# EAGLE design wall-e (EAGLE 8.1.0)
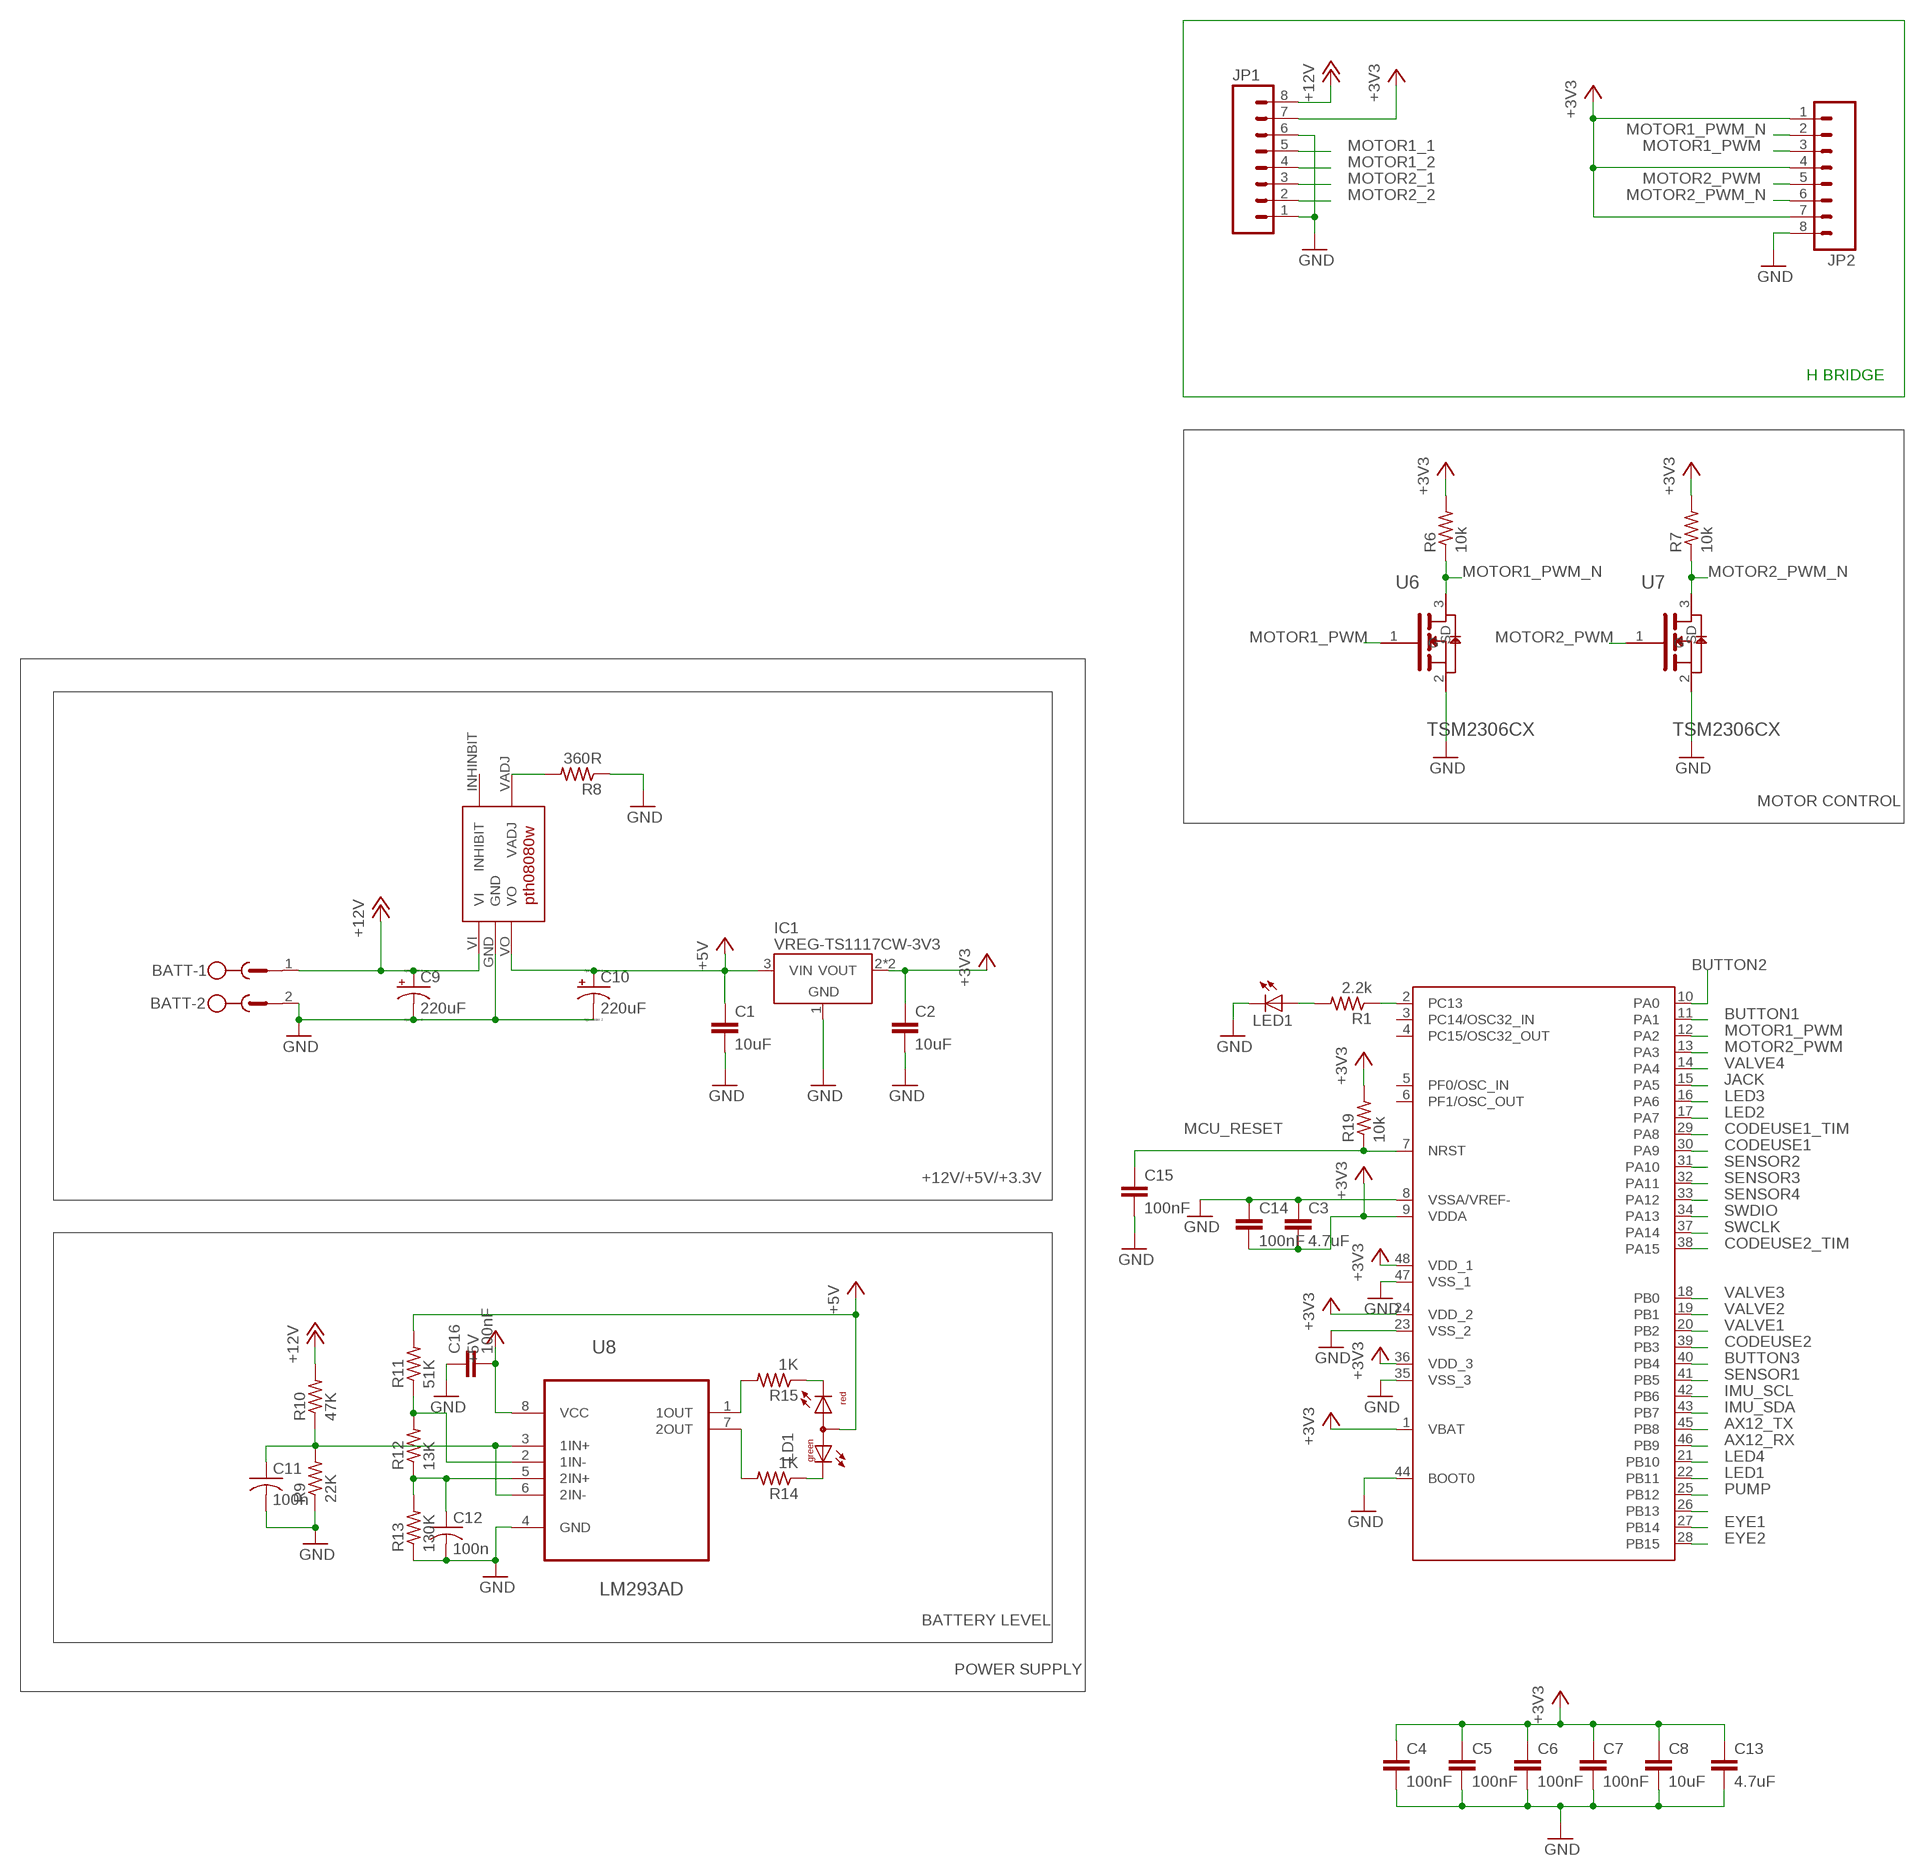
[diagram p0: schematic, sheet 1, part 1 of 2]
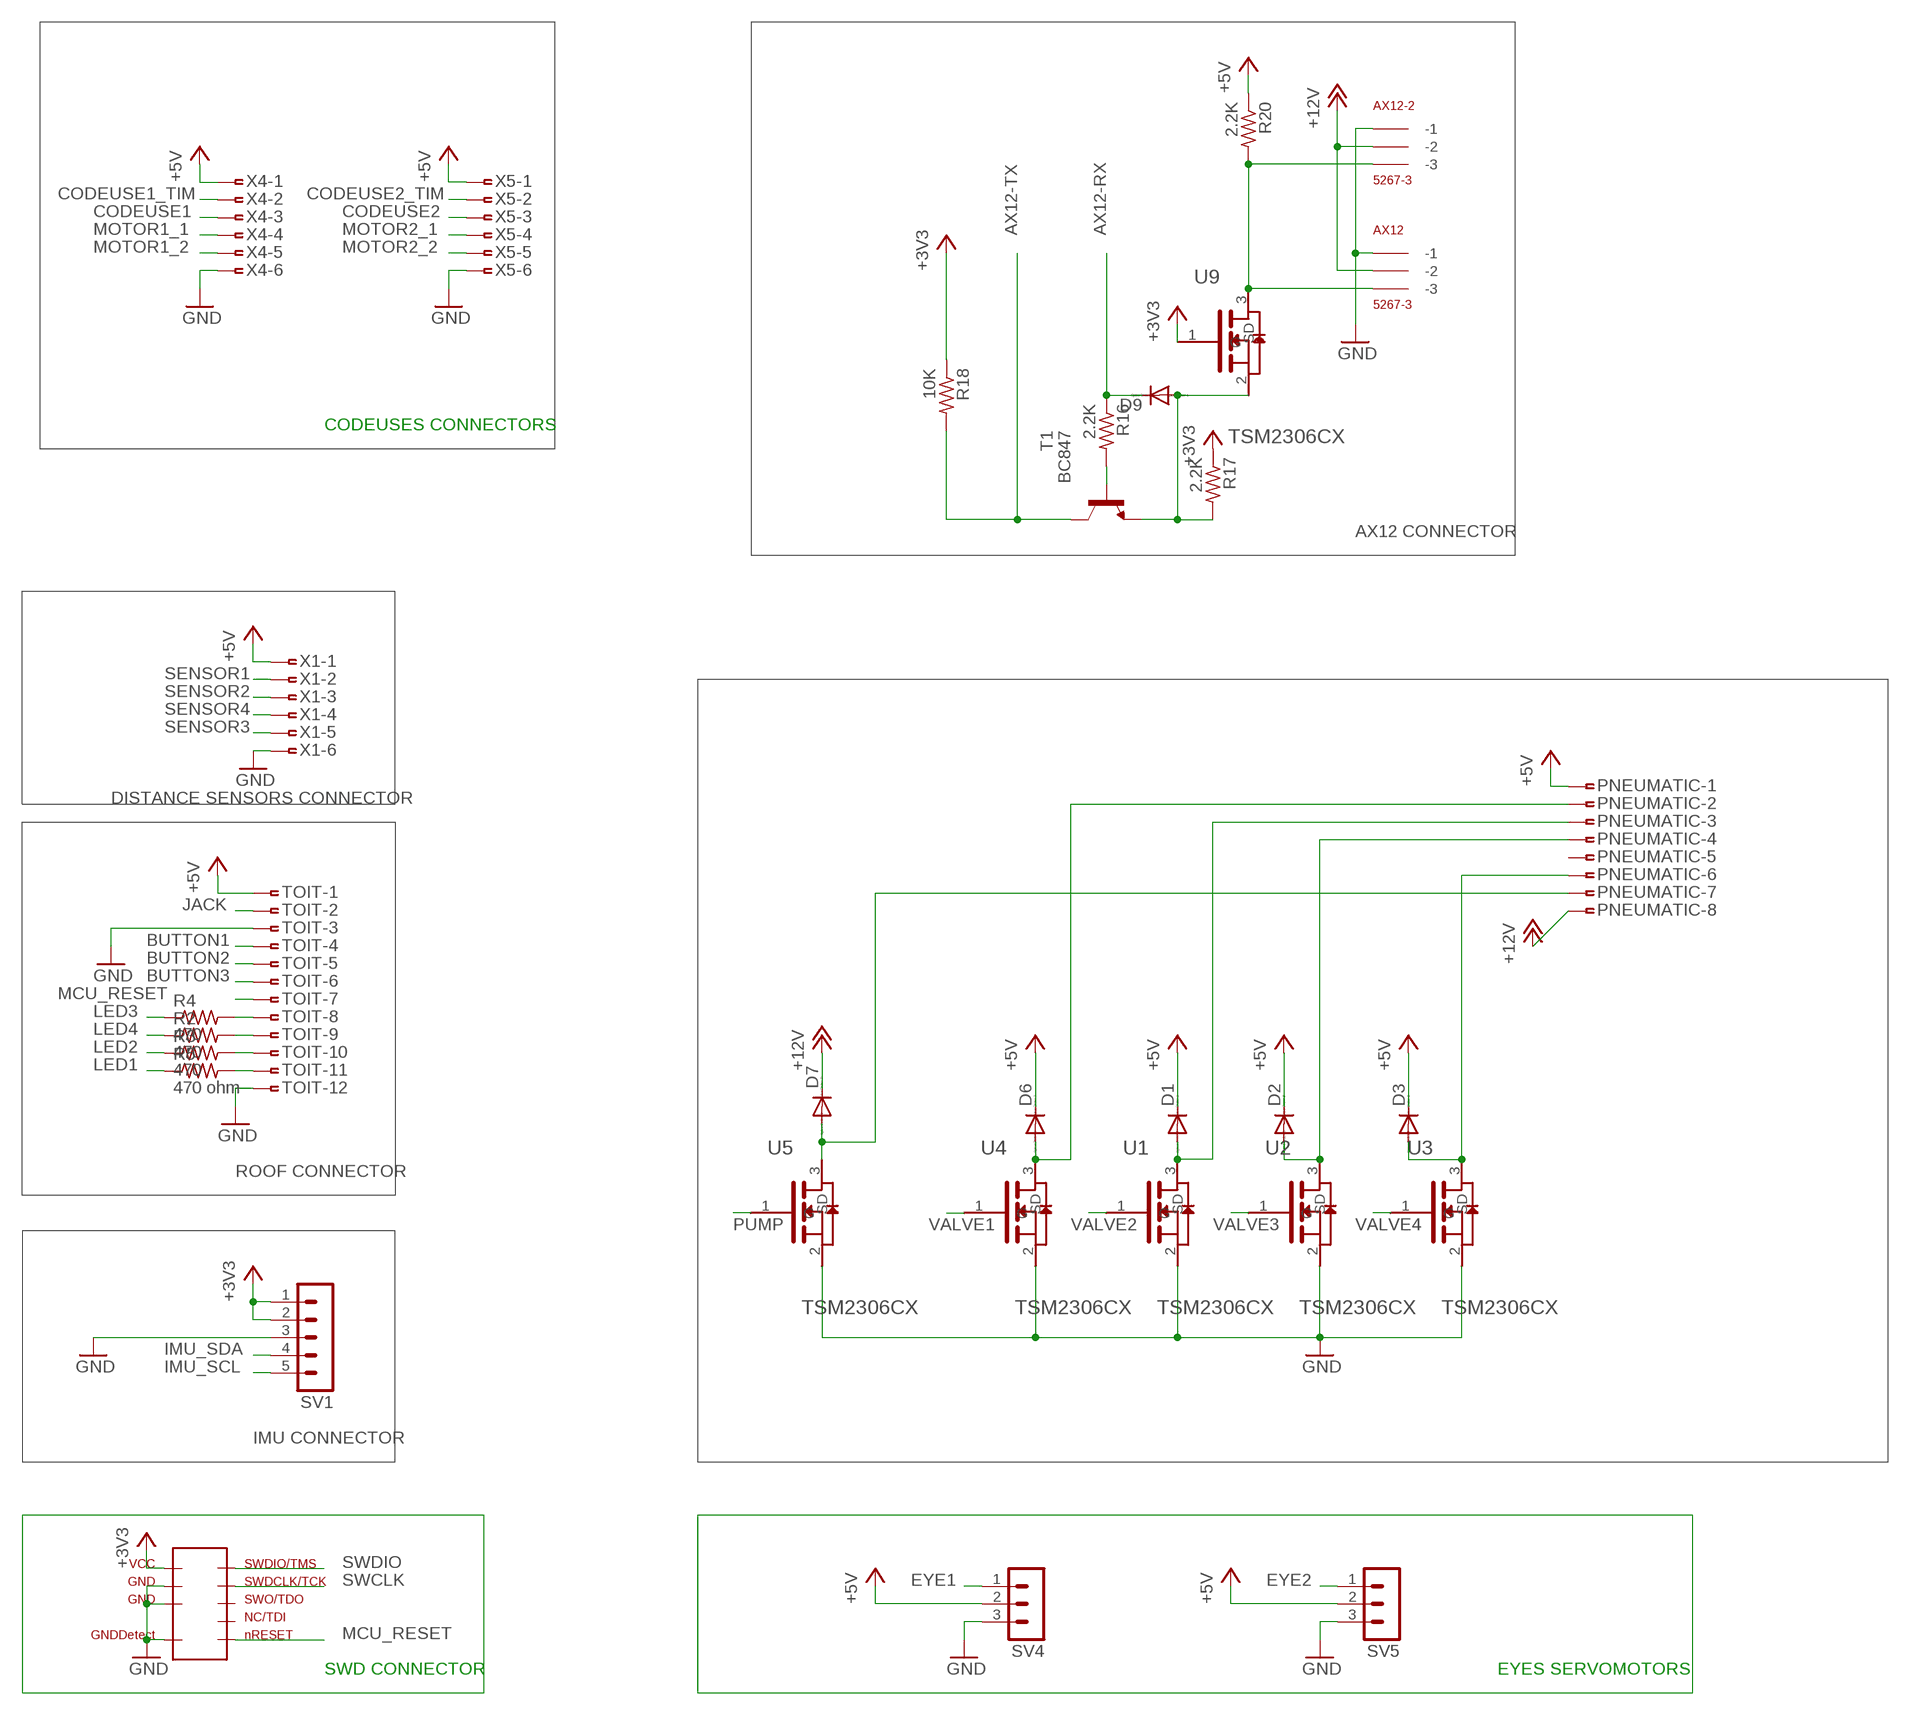
[diagram p1: schematic, sheet 1, part 2 of 2]

## Parts
AX12  5267-3  [5267-3]
AX12-2  5267-3  [5267-3]
BATT  MSTBV2  [MSTBV2]
C1  10uF  C-EUC0805  [C0805]
C2  10uF  C-EUC0805  [C0805]
C3  4.7uF  C-EUC0805  [C0805]
C4  100nF  C-EUC0805  [C0805]
C5  100nF  C-EUC0805  [C0805]
C6  100nF  C-EUC0805  [C0805]
C7  100nF  C-EUC0805  [C0805]
C8  10uF  C-EUC0805  [C0805]
C9  220uF  CPOL-USE3.5-8  [E3,5-8]
C10  220uF  CPOL-USE2.5-7  [E2,5-7]
C11  100n  C-USC0805  [C0805]
C12  100n  C-USC0805  [C0805]
C13  4.7uF  C-EUC0805  [C0805]
C14  100nF  C-EUC0805  [C0805]
C15  100nF  C-EUC0805  [C0805]
C16  100nF  C-EUC0805  [C0805]
D1  DIODE-SOD323-R  [SOD323-R]
D2  DIODE-SOD323-R  [SOD323-R]
D3  DIODE-SOD323-R  [SOD323-R]
D6  DIODE-SOD323-R  [SOD323-R]
D7  DIODE-SOD323-R  [SOD323-R]
D9  DIODE-SOD523  [SOD523]
IC1  VREG-TS1117CW-3V3  [SOT223]
JP1  M08LONGPADS  [1X08_LONGPADS]
JP2  M08LONGPADS  [1X08_LONGPADS]
LD1  DUOLED-RG-A  [DUOLED-A-5MM]
LED1  LEDCHIP-LED0805  [CHIP-LED0805]
PNEUMATIC  SMDTOP-8  [SMDTOP8]
R1  2.2k  R-US_R0805  [R0805]
R2  470  R-US_R0805  [R0805]
R3  470  R-US_R0805  [R0805]
R4  470  R-US_R0805  [R0805]
R5  470 ohm  R-US_R0805  [R0805]
R6  10k  R-US_R0805  [R0805]
R7  10k  R-US_R0805  [R0805]
R8  360R  R-US_R0805  [R0805]
R9  22K  R-US_R0805  [R0805]
R10  47K  R-US_R0805  [R0805]
R11  51K  R-US_R0805  [R0805]
R12  13K  R-US_R0805  [R0805]
R13  130K  R-US_R0805  [R0805]
R14  1K  R-US_R0805  [R0805]
R15  1K  R-US_R0805  [R0805]
R16  2.2K  R-US_R0805  [R0805]
R17  2.2K  R-US_R0805  [R0805]
R18  10K  R-US_R0805  [R0805]
R19  10k  R-US_R0805  [R0805]
R20  2.2K  R-US_R0805  [R0805]
SV1  MA05-1  [MA05-1]
SV4  MA03-1  [MA03-1]
SV5  MA03-1  [MA03-1]
T1  BC847  [SOT23]
TOIT  SMDTOP-12  [SMDTOP12]
U1  TSM2306CX  [SOT95P280X130-3N]
U2  TSM2306CX  [SOT95P280X130-3N]
U3  TSM2306CX  [SOT95P280X130-3N]
U4  TSM2306CX  [SOT95P280X130-3N]
U5  TSM2306CX  [SOT95P280X130-3N]
U6  TSM2306CX  [SOT95P280X130-3N]
U7  TSM2306CX  [SOT95P280X130-3N]
U8  LM293AD  [SOIC127P600X175-8N]
U9  TSM2306CX  [SOT95P280X130-3N]
U$1  STM32F301C8  [TQFP48]
U$2  REGUL_PTH  [REGUL_PTH]
U$3  SWD/JTAG-_PINS  [SAMTEC_SHF-105-01-L-D-SM]
X1  SMDTOP-6  [SMDTOP6]
X4  SMDTOP-6  [SMDTOP6]
X5  SMDTOP-6  [SMDTOP6]

## Nets
+3V3: C2.1 C3.2 C4.1 C5.1 C6.1 C7.1 C8.1 C13.1 C14.2 IC1.2(VOUT) IC1.4(VOUT) JP1.7 JP2.1 JP2.4 JP2.7 R6.2 R7.2 R17.1 R18.1 R19.2 SV1.1 SV1.2 U9.1(G) U$1.1(VBAT) U$1.9(VDDA) U$1.24(VDD_2) U$1.36(VDD_3) U$1.48(VDD_1) U$3.P$1
+5V: C1.1 C10.+ C16.2 D1.C D2.C D3.C D6.C IC1.3(VIN) LD1.A PNEUMATIC.1 R11.2 R20.1 SV4.2 SV5.2 TOIT.1 U8.8(VCC) U$2.VO X1.1 X4.1 X5.1
+12V: AX12-2.P$2(-2) AX12.P$2(-2) BATT.1 C9.+ D7.C JP1.8 PNEUMATIC.8 R10.2 U$2.VI
AX12-RX: D9.C R16.1
AX12-TX: R18.2 T1.3(C)
AX12_RX: U$1.46(PB9)
AX12_TX: U$1.45(PB8)
BUTTON1: TOIT.4 U$1.11(PA1)
BUTTON2: TOIT.5 U$1.10(PA0)
BUTTON3: TOIT.6 U$1.40(PB4)
CODEUSE1: U$1.30(PA9) X4.3
CODEUSE1_TIM: U$1.29(PA8) X4.2
CODEUSE2: U$1.39(PB3) X5.3
CODEUSE2_TIM: U$1.38(PA15) X5.2
EYE1: SV4.1 U$1.27(PB14)
EYE2: SV5.1 U$1.28(PB15)
GND: AX12-2.P$1(-1) AX12.P$1(-1) BATT.2 C1.2 C2.2 C3.1 C4.2 C5.2 C6.2 C7.2 C8.2 C9.- C10.- C11.2 C12.2 C13.2 C14.1 C15.2 C16.1 IC1.1(GND) JP1.1 JP1.6 JP2.8 LED1.C R8.1 R9.1 R13.1 SV1.3 SV4.3 SV5.3 TOIT.3 TOIT.12 U1.2(S) U2.2(S) U3.2(S) U4.2(S) U5.2(S) U6.2(S) U7.2(S) U8.4(GND) U$1.8(VSSA/VREF-) U$1.23(VSS_2) U$1.35(VSS_3) U$1.44(BOOT0) U$1.47(VSS_1) U$2.GND U$3.P$3 U$3.P$5 U$3.P$9 X1.6 X4.6 X5.6
IMU_SCL: SV1.5 U$1.42(PB6)
IMU_SDA: SV1.4 U$1.43(PB7)
JACK: TOIT.2 U$1.15(PA5)
LED1: R5.1 U$1.22(PB11)
LED2: R3.1 U$1.17(PA7)
LED3: R4.1 U$1.16(PA6)
LED4: R2.1 U$1.21(PB10)
MCU_RESET: C15.1 R19.1 TOIT.7 U$1.7(NRST) U$3.P$10
MOTOR1_1: JP1.5 X4.4
MOTOR1_2: JP1.4 X4.5
MOTOR1_PWM: JP2.3 U6.1(G) U$1.12(PA2)
MOTOR1_PWM_N: JP2.2 R6.1 U6.3(D)
MOTOR2_1: JP1.3 X5.4
MOTOR2_2: JP1.2 X5.5
MOTOR2_PWM: JP2.5 U7.1(G) U$1.13(PA3)
MOTOR2_PWM_N: JP2.6 R7.1 U7.3(D)
N$1: R5.2 TOIT.11
N$2: R3.2 TOIT.10
N$3: R2.2 TOIT.9
N$4: R4.2 TOIT.8
N$5: D1.A PNEUMATIC.3 U1.3(D)
N$6: D2.A PNEUMATIC.4 U2.3(D)
N$7: D3.A PNEUMATIC.6 U3.3(D)
N$8: D6.A PNEUMATIC.2 U4.3(D)
N$9: D7.A PNEUMATIC.7 U5.3(D)
N$11: R1.1 U$1.2(PC13)
N$13: R8.2 U$2.VADJ
N$14: R15.2 U8.1(1OUT)
N$15: LD1.CR R15.1
N$16: R14.2 U8.7(2OUT)
N$17: LD1.CX(CG) R14.1
N$18: LED1.A R1.2
N$19: C11.1 R9.2 R10.1 U8.3(1IN+) U8.6(2IN-)
N$20: R11.1 R12.2 U8.2(1IN-)
N$21: C12.1 R12.1 R13.2 U8.5(2IN+)
N$22: U$1.26(PB13)
N$23: AX12-2.P$3(-3) AX12.P$3(-3) R20.2 U9.3(D)
N$24: R16.2 T1.1(B)
N$25: D9.A R17.2 T1.2(E) U9.2(S)
PUMP: U5.1(G) U$1.25(PB12)
SENSOR1: U$1.41(PB5) X1.2
SENSOR2: U$1.31(PA10) X1.3
SENSOR3: U$1.32(PA11) X1.5
SENSOR4: U$1.33(PA12) X1.4
SWCLK: U$1.37(PA14) U$3.P$4
SWDIO: U$1.34(PA13) U$3.P$2
VALVE1: U4.1(G) U$1.20(PB2)
VALVE2: U1.1(G) U$1.19(PB1)
VALVE3: U2.1(G) U$1.18(PB0)
VALVE4: U3.1(G) U$1.14(PA4)
Unconnected: PNEUMATIC.5 U$1.3(PC14/OSC32_IN) U$1.4(PC15/OSC32_OUT) U$1.5(PF0/OSC_IN) U$1.6(PF1/OSC_OUT) U$2.INHINBIT(INHIBIT) U$3.P$6 U$3.P$8

## Notes on the sheet
- H BRIDGE
- MOTOR CONTROL | CODEUSES CONNECTORS
- AX12 CONNECTOR
- DISTANCE SENSORS CONNECTOR
- +12V/+5V/+3.3V
- ROOF CONNECTOR
- BATTERY LEVEL
- POWER SUPPLY
- IMU CONNECTOR
- SWD CONNECTOR | EYES SERVOMOTORS

## Library data of the parts
AX12 AX12-2 = con-molex-spox:5267-3
BATT = con-phoenix-500:MSTBV2: PHOENIX; OC_FARNELL: unknown; OC_NEWARK: unknown
C1-C8 C13-C16 = rcl:C-EU: CAPACITOR, European symbol
C9 C10 = resistor:CPOL-US: POLARIZED CAPACITOR, American symbol
C11 C12 = resistor:C-US: CAPACITOR, American symbol
D1-D3 D6 D7 D9 = diode:DIODE-: DIODE
IC1 = we-power:VREG: Voltage Regulators (LDOs, Switching Converters...) LDOs Taiwan Semi TS1117 800mA max 15V - compatible On Semi NCP1117 1A max 20V Taiwan Semi TS9011 250mA max 12V - compatible Diodes AP2210 300mA max 15V - compatible Microchip MCP1702 250mA max 13V - compatible Microchip MCP1703 250mA max 16V - compatible Microchip MCP1754 150mA max 16V Taiwan Semi TS5204 150mA max 16V (low noise) DC/DC Converter Modules Recom R-78Ex.x-1.0-W36 1A max 28V Murata OKI-78SR-x.x/1.5-W36 1.5A max 36V CUI V78xx-2000 2A max 18V
JP1 JP2 = SparkFun:M08: Header 8 Standard 8-pin 0.1" header. Use with straight break away headers (SKU : PRT-00116), right angle break away headers (PRT-00553), swiss pins (PRT-00743), machine pins (PRT-00117), and female headers (PRT-00115).
LD1 = led:DUOLED-RG-A: DUO LED 2 colors (red/green), 5 mm, round, common Anode www.ligitek.com or other producers.
LED1 = led:LED: LED OSRAM: - CHIPLED LG R971, LG N971, LY N971, LG Q971, LY Q971, LO R971, LY R971 LH N974, LH R974 LS Q976, LO Q976, LY Q976 LO Q996 - Hyper CHIPLED LW Q18S LB Q993, LB Q99A, LB R99A - SideLED LS A670, LO A670, LY A670, LG A670, LP A670 LB A673, LV A673, LT A673, LW A673 LH A674 LY A675 LS A676, LA A676, LO A676, LY A676, LW A676 LS A679, LY A679, LG A679 - Hyper Micro SIDELED® LS Y876, LA Y876, LO Y876, LY Y876 LT Y87S - SmartLED LW L88C, LW L88S LB L89C, LB L89S, LG L890 LS L89K, LO L89K, LY L89K LS L896, LA L896, LO L896, LY L896 - TOPLED LS T670, LO T670, LY T670, LG T670, LP T670 LSG T670, LSP T670, LSY T670, LOP T670, LYG T670 LG T671, LOG T671, LSG T671 LB T673, LV T673, LT T673, LW T673 LH T674 LS T676, LA T676, LO T676, LY T676, LB T676, LH T676, LSB T676, LW T676 LB T67C, LV T67C, LT T67C, LS T67K, LO T67K, LY T67K, LW E67C LS E67B, LA E67B, LO E67B, LY E67B, LB E67C, LV E67C, LT E67C LW T67C LS T679, LY T679, LG T679 LS T770, LO T770, LY T770, LG T770, LP T770 LB T773, LV T773, LT T773, LW T773 LH T774 LS E675, LA E675, LY E675, LS T675 LS T776, LA T776, LO T776, LY T776, LB T776 LHGB T686 LT T68C, LB T68C - Hyper Mini TOPLED® LB M676 - Mini TOPLED Santana® LG M470 LS M47K, LO M47K, LY M47K Source: http://www.osram.convergy.de LUXEON: - LUMILED® LXK2-PW12-R00, LXK2-PW12-S00, LXK2-PW14-U00, LXK2-PW14-V00 LXK2-PM12-R00, LXK2-PM12-S00, LXK2-PM14-U00 LXK2-PE12-Q00, LXK2-PE12-R00, LXK2-PE12-S00, LXK2-PE14-T00, LXK2-PE14-U00 LXK2-PB12-K00, LXK2-PB12-L00, LXK2-PB12-M00, LXK2-PB14-N00, LXK2-PB14-P00, LXK2-PB14-Q00 LXK2-PR12-L00, LXK2-PR12-M00, LXK2-PR14-Q00, LXK2-PR14-R00 LXK2-PD12-Q00, LXK2-PD12-R00, LXK2-PD12-S00 LXK2-PH12-R00, LXK2-PH12-S00 LXK2-PL12-P00, LXK2-PL12-Q00, LXK2-PL12-R00 Source: www.luxeon.com KINGBRIGHT: KA-3528ASYC Source: www.kingbright.com
PNEUMATIC = con-amp:SMDTOP-8: AMP connector
R1-R7 R19 = rcl:R-US_: RESISTOR, American symbol
R8-R18 R20 = resistor:R-US_: RESISTOR, American symbol
SV1 = con-lstb:MA05-1: PIN HEADER; OC_FARNELL: unknown; OC_NEWARK: unknown
SV4 SV5 = con-lstb:MA03-1: PIN HEADER; OC_FARNELL: unknown; OC_NEWARK: unknown
T1 = transistor:BC847: NPN TRANSISTOR
TOIT = con-amp:SMDTOP-12: AMP connector
U1-U7 U9 = tsm2306:TSM2306CX: 30V N-Channel MOSFET; MPN: TSM2306CX; OC_FARNELL: 1864577; OC_NEWARK: 27T2993; PACKAGE: SOT-23-3; SUPPLIER: TAIWAN SEMICONDUCTOR
U8 = LM293ADR:LM293AD: DUAL DIFFERENTIAL COMPARATORS; MPN: LM293AD; OC_FARNELL: 8389225; OC_NEWARK: 38K3696; PACKAGE: SOIC-8; SUPPLIER: TI
U$1 = stm32:STM32F301C8
U$2 = regul_pth:REGUL_PTH: "adjustable voltage regulator pth08080w"
U$3 = TelecomRobotics:SWD/JTAG-_PINS
X1 X4 X5 = con-amp:SMDTOP-6: AMP connector

## Board
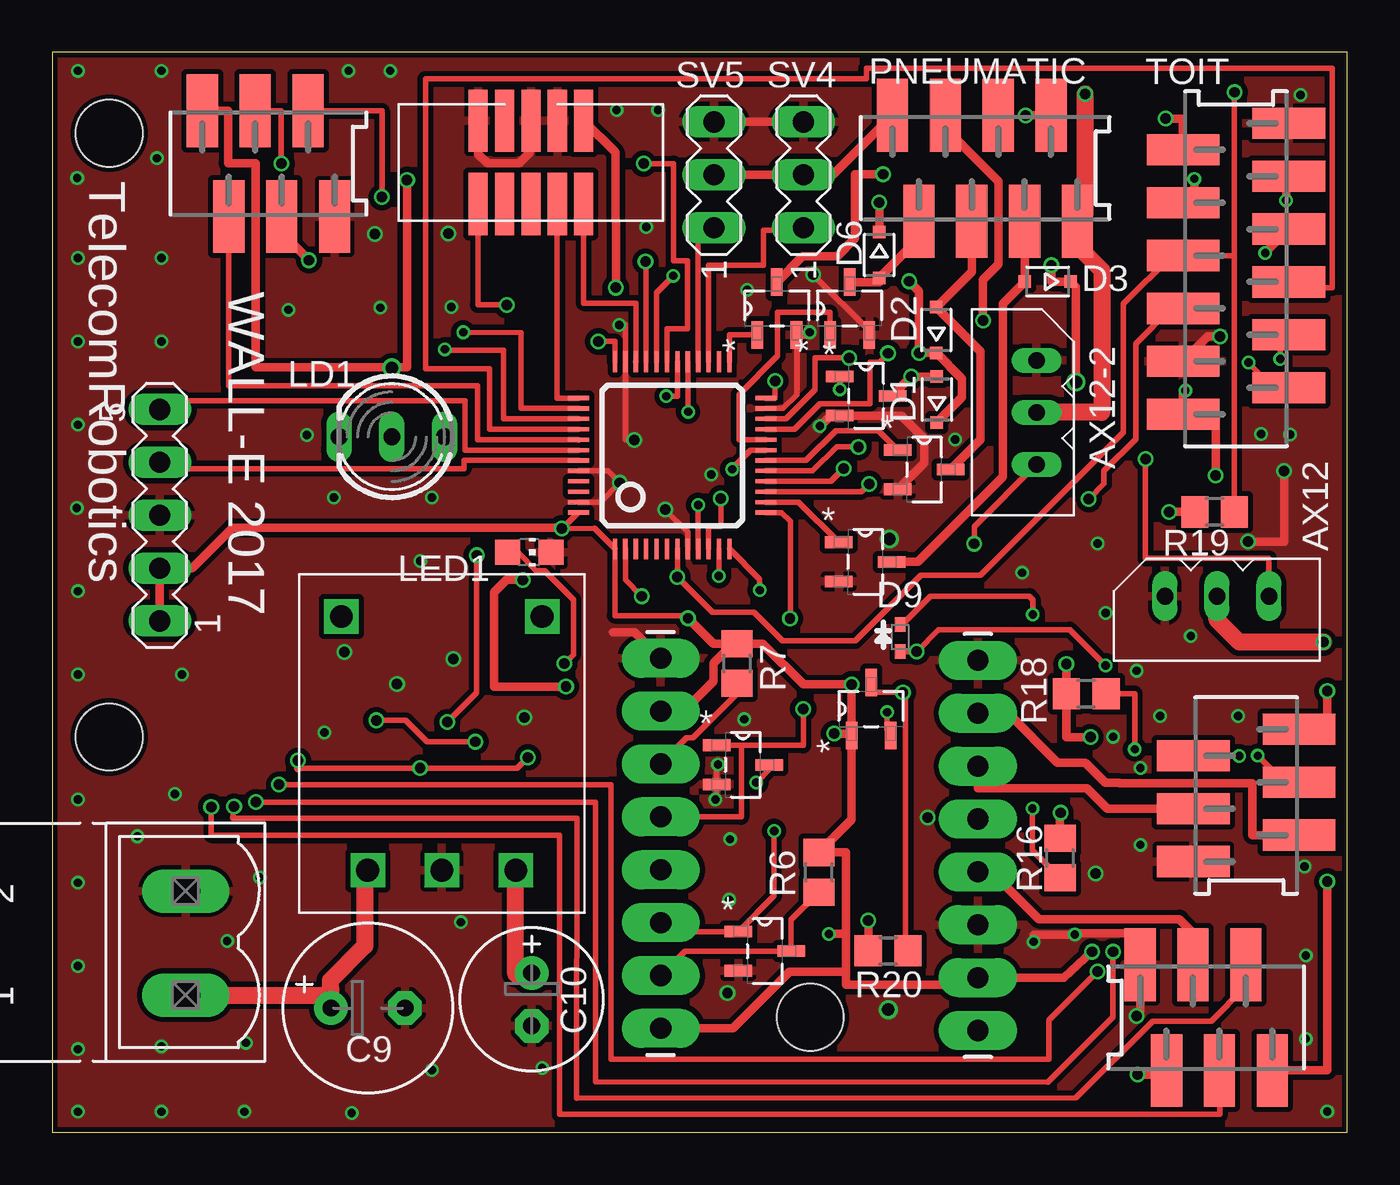
[diagram p2: board, top side]
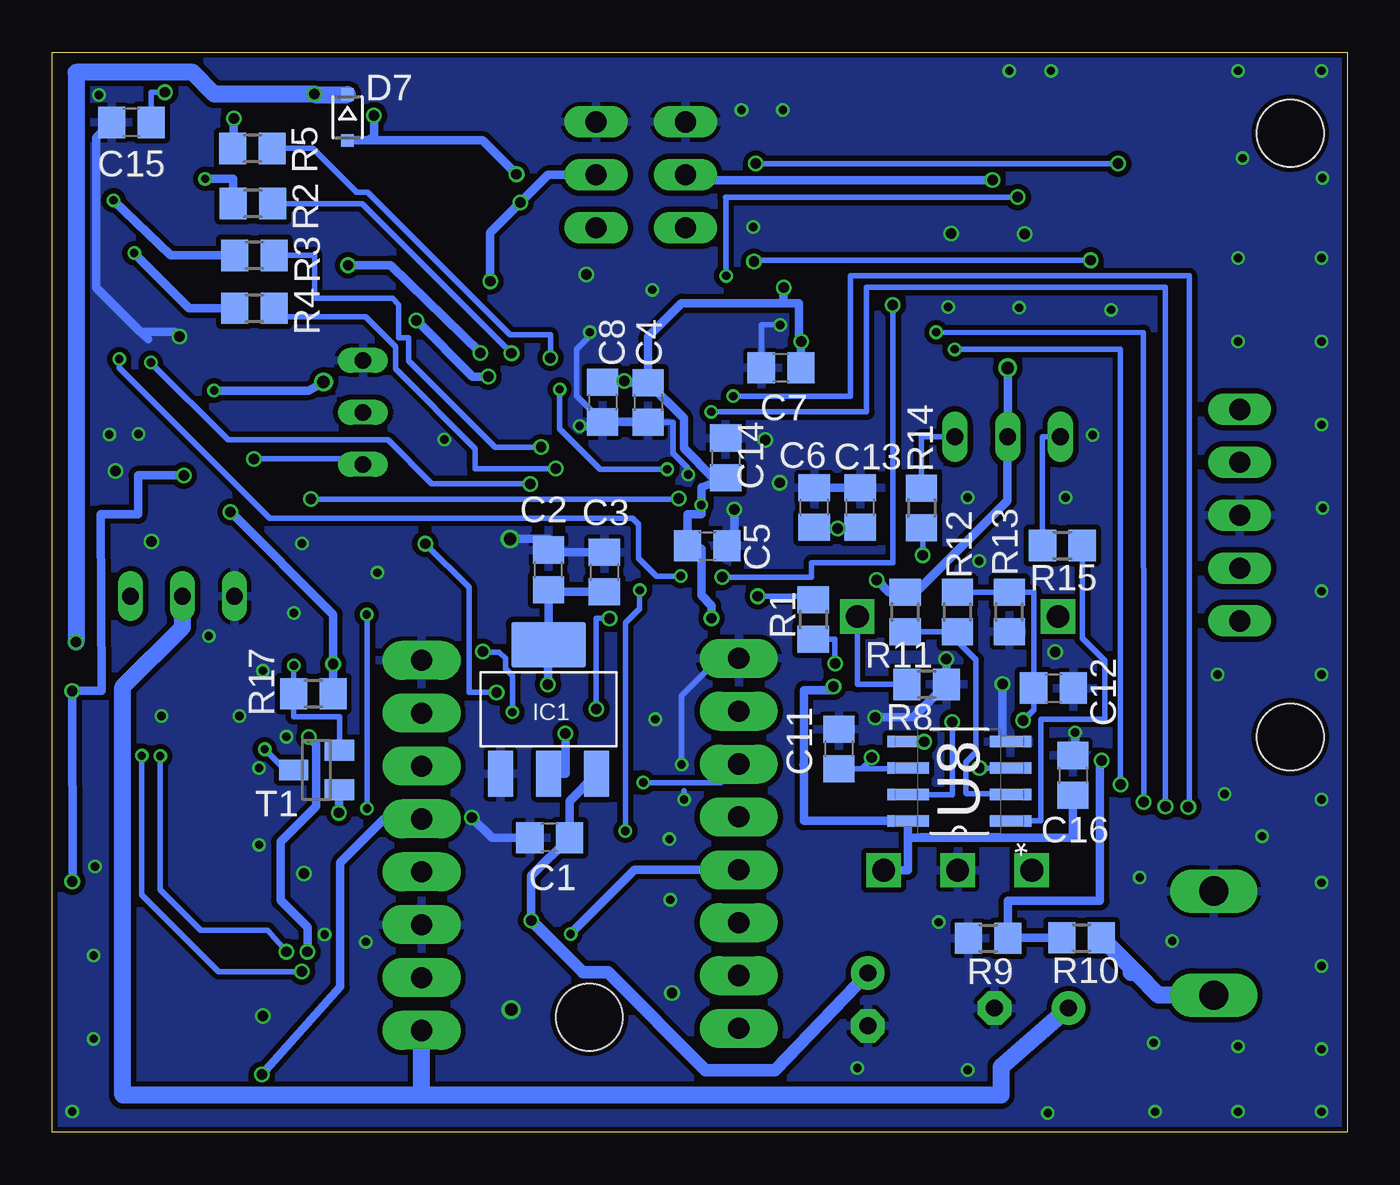
[diagram p3: board, bottom side, seen from below]

Size 62.25 x 51.9 mm. Coordinates in mm from the lower left corner, seen from the top.
Outline: 0,0 62.25,0 62.25,51.9 0,51.9 0,0
Copper layers (1*16): Top 0.018mm / dielectric 1.55mm / Bottom 0.018mm
Design rules "eC_2Layer_PClass6_BaseCopperO18_eCDefault": minimum track width 0.15mm, minimum drill 0.35mm, track to track 0.15mm, track to pad 0.15mm, pad to pad 0.15mm, via to via 0.15mm, smd to smd 0mil, copper to edge 0.25mm, drill to drill 0.35mm, minimum pad ring 0.175mm, minimum via ring 0.125mm, stop-mask expansion 0mil, vias tented up to drill 0.45mm, thermal gap 0.2mm
Holes 3.2 mm at 2.75,48 2.75,19 36.43,5.54

### Footprints (pad centres in the part's own frame; a part is rotated, then mirrored left to right if it is on the bottom)
5267-3 = drill 0.8 long: P$1 0,0; P$2 2.5,0; P$3 5,0
MSTBV2 = drill 1.397 long: 1 -2.5,0; 2 2.5,0
C0805 = smd 1.3 x 1.5: 1 -0.95,0; 2 0.95,0
E3,5-8 = drill 0.813 pad 1.6: + -1.778,0 | drill 0.813 pad 1.6 octagon: - 1.778,0
E2,5-7 = drill 0.813 pad 1.6: + -1.27,0 | drill 0.813 pad 1.6 octagon: - 1.27,0
SOD323-R = smd 0.6 x 0.6: A 1.1,0; C -1.1,0
SOD523 = smd 0.7 x 0.5: A 0.7,0; C -0.6,0
SOT223 = smd 2.235 x 1.219: 1 -3.099,2.311; 2 -3.099,0; 3 -3.099,-2.311 | smd 2.2 x 3.6: 4 3.099,0
1X08_LONGPADS = drill 1.016 pad 1.88 long: 1 0,0; 2 2.54,0; 3 5.08,0; 4 7.62,0; 5 10.16,0; 6 12.7,0; 7 15.24,0; 8 17.78,0
DUOLED-A-5MM = drill 0.813 long: A 0,0; CR 2.54,0; CX -2.54,0
CHIP-LED0805 = smd 1.2 x 1.2: A 0,-1.05; C 0,1.05
SMDTOP8 = smd 1.5 x 3.5: 1 -4.445,2.54; 2 -3.175,-2.54; 3 -1.905,2.54; 4 -0.635,-2.54; 5 0.635,2.54; 6 1.905,-2.54; 7 3.175,2.54; 8 4.445,-2.54
R0805 = smd 1.3 x 1.5: 1 -0.95,0; 2 0.95,0
MA05-1 = drill 1.016 long: 1 -5.08,0; 2 -2.54,0; 3 0,0; 4 2.54,0; 5 5.08,0
MA03-1 = drill 1.016 long: 1 -2.54,0; 2 0,0; 3 2.54,0
SOT23 = smd 1 x 1.4: 1 -0.95,-1.1; 2 0.95,-1.1; 3 0,1.1
SMDTOP12 = smd 1.5 x 3.5: 1 -6.985,2.54; 2 -5.715,-2.54; 3 -4.445,2.54; 4 -3.175,-2.54; 5 -1.905,2.54; 6 -0.635,-2.54; 7 0.635,2.54; 8 1.905,-2.54; 9 3.175,2.54; 10 4.445,-2.54; 11 5.715,2.54; 12 6.985,-2.54
SOT95P280X130-3N = smd 1.321 x 0.559: 1 -1.27,0.94; 2 -1.27,-0.94; 3 1.27,0
SOIC127P600X175-8N = smd 1.981 x 0.559: 1 -2.464,1.905; 2 -2.464,0.635; 3 -2.464,-0.635; 4 -2.464,-1.905; 5 2.464,-1.905; 6 2.464,-0.635; 7 2.464,0.635; 8 2.464,1.905
TQFP48 = smd 0.2 x 1: 1 -2.75,-4.5; 2 -2.25,-4.5; 3 -1.75,-4.5; 4 -1.25,-4.5; 5 -0.75,-4.5; 6 -0.25,-4.5; 7 0.25,-4.5; 8 0.75,-4.5; 9 1.25,-4.5; 10 1.75,-4.5; 11 2.25,-4.5; 12 2.75,-4.5; 25 2.75,4.5; 26 2.25,4.5; 27 1.75,4.5; 28 1.25,4.5; 29 0.75,4.5; 30 0.25,4.5; 31 -0.25,4.5; 32 -0.75,4.5; 33 -1.25,4.5; 34 -1.75,4.5; 35 -2.25,4.5; 36 -2.75,4.5 | smd 1 x 0.2: 13 4.5,-2.75; 14 4.5,-2.25; 15 4.5,-1.75; 16 4.5,-1.25; 17 4.5,-0.75; 18 4.5,-0.25; 19 4.5,0.25; 20 4.5,0.75; 21 4.5,1.25; 22 4.5,1.75; 23 4.5,2.25; 24 4.5,2.75; 37 -4.5,2.75; 38 -4.5,2.25; 39 -4.5,1.75; 40 -4.5,1.25; 41 -4.5,0.75; 42 -4.5,0.25; 43 -4.5,-0.25; 44 -4.5,-0.75; 45 -4.5,-1.25; 46 -4.5,-1.75; 47 -4.5,-2.25; 48 -4.5,-2.75
REGUL_PTH = drill 1.1 square: GND -6.096,1.27; INHINBIT 6.096,6.096; VADJ 6.096,-3.556; VI -6.096,4.826; VO -6.096,-2.286
SAMTEC_SHF-105-01-L-D-SM = smd 3 x 0.914: P$1 -2,2.54; P$2 2,2.54; P$3 -2,1.27; P$4 2,1.27; P$5 -2,0; P$6 2,0; P$7 -2,-1.27; P$8 2,-1.27; P$9 -2,-2.54; P$10 2,-2.54
SMDTOP6 = smd 1.5 x 3.5: 1 -3.175,2.54; 2 -1.905,-2.54; 3 -0.635,2.54; 4 0.635,-2.54; 5 1.905,2.54; 6 3.175,-2.54

### Placement (x,y rotation side)
AX12  53.48,25.76 0 top
AX12-2  47.31,37.09 270 top
BATT  6.42,9.1 90 top
C1  38.34,14.16 180 bottom
C2  38.39,27.03 90 bottom
C3  35.71,26.93 270 bottom
C4  33.61,35.07 270 bottom
C5  30.77,28.18 0 bottom
C6  25.62,30.02 90 bottom
C7  27.22,36.73 180 bottom
C8  35.79,35.08 270 bottom
C9  15.18,5.98 0 top
C10  23.05,6.39 270 top
C11  24.43,18.43 90 bottom
C12  14.13,21.35 0 bottom
C13  23.41,30.02 90 bottom
C14  29.88,32.41 270 bottom
C15  58.43,48.52 180 bottom
C16  13.19,17.16 270 bottom
D1  42.52,35.21 90 top
D2  42.49,38.55 90 top
D3  47.84,40.87 180 top
D6  39.75,42.15 270 top
D7  48.05,48.76 270 bottom
D9  40.75,23.8 270 top
IC1  38.39,20.33 90 bottom
JP1  44.49,22.68 270 top
JP2  29.25,5 90 top
LD1  16.33,33.42 180 top
LED1  22.93,27.87 270 top
PNEUMATIC  44.83,46.32 0 top
R1  25.67,24.64 270 bottom
R2  52.6,44.62 180 bottom
R3  52.53,42.13 180 bottom
R4  52.52,39.59 180 bottom
R5  52.62,47.27 180 bottom
R6  36.85,12.5 90 top
R7  32.92,22.53 90 top
R8  20.22,21.52 180 bottom
R9  17.26,9.33 0 bottom
R10  12.78,9.35 0 bottom
R11  21.25,25 90 bottom
R12  18.75,25 270 bottom
R13  16.25,25 90 bottom
R14  20.47,30 270 bottom
R15  13.7,28.2 0 bottom
R16  48.44,13.18 90 top
R17  49.69,21.07 180 bottom
R18  49.7,21.08 0 top
R19  55.87,29.81 180 top
R20  40.17,8.73 0 top
SV1  5.18,29.65 90 top
SV4  36.11,46 90 top
SV5  31.81,46 90 top
T1  49.54,17.41 90 bottom
TOIT  56.89,41.49 90 top
U1  39.12,35.38 0 top
U2  41.91,31.84 0 top
U3  39.08,27.41 0 top
U4  38.33,39.58 90 top
U5  34.83,39.58 90 top
U6  34.25,8.71 0 top
U7  33.2,17.66 0 top
U8  18.65,16.87 180 bottom
U9  39.36,20.34 90 top
U$1  29.8,32.53 0 top
U$2  20,18.69 90 top
U$3  23.01,46.6 270 top
X1  10.4,46.54 0 top
X4  55.46,5.52 180 top
X5  57.38,16.19 270 top

### Tracks (layer width: path | path; a pad name or v marks a point on that pad's centre or on a via)
+3V3  (via drill 0.4, 0.5)
  Top 0.254: U$1.9 v31.05,30.14 | U$1.48 25.27,29.78 v24.5,29.01 26.08,29.03 U$1.1 27.05,24.83 30.43,24.83 | U$1.24 34.75,35.28 v34.75,36.1 | v26.25,38 27.05,38 U$1.36
  Top 0.406: SV1.1 SV1.2 6.73,27.11 8.68,29.06 24.45,29.06 v24.5,29.01 | U$3.P$1 27.07,47.08 v27.09,40.58 | U9.1 38.42,15.02 R6.2 38.15,13.45 38.15,9.52 | v53.67,29.81 R19.2 | U9.1 v38.42,21.52 36.1,21.52 34.17,23.45 34.17,23.48 R7.2 | U9.1 38.42,19.16 v37.58,19.16 | R7.2 31.78,23.48 v30.56,24.7 30.43,24.83 | R7.2 32.72,23.48 31.78,22.54 31.78,21.67 30.35,20.24 JP2.7 | 38.15,9.52 38.15,7.7 | 38.15,7.7 38.15,7.09 44.14,7.09 JP1.7 48.62,7.44 v49.97,8.68 | v48.74,22.5 v48.75,22.5 R18.1 48.75,18.99 v49.9,18.99 | JP2.1 32.72,5 35.44,7.72 38.13,7.72 38.15,7.7 | v37.33,9.54 38.13,9.54 38.15,9.52
  Bottom 0.254: U$1.9 31.2,28.18
  Bottom 0.406: C4.1 34.75,36.02 v34.75,36.1 35.79,36.1 C8.1 | C7.1 26.27,37.8 v26.25,38 26.35,38 26.35,39.84 27.09,39.84 | C5.1 31.72,29.7 31.05,29.7 v31.05,30.14 31.05,30.99 C14.2 30.48,31.46 31.89,32.87 31.89,34.3 C4.1 | C5.1 32.11,27.79 32.11,27.64 | C3.2 38.29,25.98 C2.1 IC1.4 38.42,23.43 v38.42,21.52 | U$1.9 31.05,25.8 30.56,25.31 v30.56,24.7 | 31.2,28.18 C5.1 | 48.37,21.44 R17.1 v48.74,22.5 48.74,24.88 v53.67,29.81 | C6.1 25.56,29.01 v24.5,29.01 24.44,29.07 C13.1 | v37.58,19.16 37.58,17.23 IC1.2 | v49.9,18.99 49.56,18.65 49.56,15.67 51.27,13.96 51.27,11.15 49.97,9.85 v49.97,8.68 | C4.1 33.61,38.22 31.99,39.84 27.09,39.84 | JP2.4 34.25,12.62 v37.33,9.54 | 27.09,39.84 v27.09,40.58
+5V  (via drill 0.4, 0.5, 0.6)
  Top 0.406: SV5.2 SV4.2 37.53,46 PNEUMATIC.1 | X1.1 8.46,49.08 8.46,46.57 9.78,46.57 9.78,36.77 16.33,36.77 | 16.33,36.77 v16.33,36.73 | v24.7,21.42 21.25,21.42 R11.2 21.84,26.54 v22.62,26.54 | v39.22,10.19 R20.1 | v48.02,41.66 48.02,40.87 D3.C 49.19,40.62 v49.2,36.05 | D6.C v39.75,44.67 | D1.C 43.73,35.32 43.73,36.21 D2.C v41.66,37.45 41.66,40.42 v41.19,40.89 | 16.33,36.77 17.06,36.77 v17.06,45.75 | TOIT.1 54.46,34.62 | X4.1 61.28,2.98 v61.28,12.06 | v61.28,21.21 61.28,19.55 X5.1 | TOIT.1 55.92,34.51 v55.92,31.56 | v54.46,35.64 54.35,35.63 TOIT.1
  Top 0.813: C10.+ 22.29,7.62 U$2.VO
  Bottom 0.406: v16.33,36.73 LD1.A 16.35,33.4 16.35,30.34 20.74,25.95 R11.2 22.03,25.95 v22.62,26.54 | 21.11,14.17 21.11,12.59 U$2.VO | 21.11,14.17 U8.8 26.11,14.96 26.11,17.69 | 26.11,17.69 26.11,21.25 24.7,21.25 v24.7,21.42 | IC1.3 37.39,15.92 C1.1 39.22,12.33 v39.22,10.19 39.2,10.19 | 26.13,17.67 26.11,17.69 | v48.02,41.66 45.97,41.66 v41.66,37.45 | 36.22,46 SV4.2 38.42,46 v39.75,44.67 41.19,43.23 v41.19,40.89 41.19,41.03 | C16.2 13.19,14.17 21.11,14.17 | v17.06,45.75 31.81,45.75 SV5.2 | v61.28,12.06 61.26,12.06 v61.28,21.21 59.86,21.22 59.92,29.69 58.12,29.69 58.12,31.56 v55.92,31.56 | v49.2,36.05 49.91,35.64 v54.46,35.64
  Bottom 0.61: v39.22,10.19 36.72,7.7 35.54,7.7 30.84,3 27.51,3 C10.+
+12V  (via drill 0.5)
  Top 0.406: 49.65,43.78 PNEUMATIC.8
  Top 0.813: AX12.P$2 55.98,24.64 57.06,23.56 v61.09,23.56 | v49.65,49.88 49.65,44.16 PNEUMATIC.8 49.28,42.59 50.44,41.42 50.44,34.59 AX12-2.P$2 | BATT.1 13.11,6.6 C9.+ 13.37,7.3 15.03,8.96 15.03,12.44 U$2.VI
  Bottom 0.406: D7.C 48.05,49.88
  Bottom 0.813: BATT.1 9.08,6.6 10.17,7.7 | R10.2 10.17,7.7 | 10.4,7.7 10.17,7.7 | D7.C 49.63,49.86 v49.65,49.88 54.45,49.88 55.49,50.92 61.09,50.92 v61.09,23.56 | C9.+ 16.65,3.14 16.65,1.8 44.49,1.8 | 44.49,1.8 JP1.8 | 44.49,1.8 58.85,1.8 58.85,21.4 55.98,24.27 AX12.P$2
AX12-RX  (via drill 0.4)
  Top 0.254: R16.1 47.11,13.56 v47.11,15.57 | 40.85,24.4 42.21,25.76 46.97,25.76 47.13,25.6 v47.13,24.88
  Top 0.406: 40.85,24.4 D9.C
  Bottom 0.254: v47.13,24.88 47.11,24.86 v47.11,15.57
AX12-TX  (via drill 0.4)
  Top 0.254: v52.03,18.41 52.03,21.08 R18.2
  Bottom 0.254: T1.3 51.03,17.41 v52.03,18.41
BUTTON1  (via drill 0.4)
  Top 0.254: v32.04,26.73 v32.05,26.74 U$1.11 | v59.02,37.15 59.02,37.91 TOIT.4
  Bottom 0.254: v32.04,26.73 33.2,26.73 34.06,27.59 34.06,29.22 34.35,29.51 51.79,29.51 59.02,36.74 v59.02,37.15
BUTTON2  (via drill 0.5)
  Top 0.254: v49.82,30.43 50.55,31.16 50.55,31.79 52.07,33.31 52.07,37.89 53.77,39.59 | U$1.10 31.55,29.11 32.15,29.11 v32.15,30.45 v32.14,30.45
  Top 0.406: TOIT.5 53.77,39.59
  Bottom 0.254: v49.82,30.43 32.16,30.43
  Bottom 0.406: 32.16,30.43 v32.14,30.45
BUTTON3
  Top 0.254: U$1.40 21.03,33.78 21.03,36.68 17.94,36.68 17.94,50.61 39.13,50.61 39.13,51.12 61.51,51.12 61.51,40.57 59.43,40.57
  Top 0.406: 59.43,40.57 TOIT.6
CODEUSE1  (via drill 0.4, 0.5)
  Top 0.254: U$1.30 30.05,35.37 v29.52,35.37 | v7.65,15.64 7.65,14.28 13.66,14.28 13.91,14.27 24.39,14.27 24.39,0.87 56.12,0.87 56.12,2.98
  Top 0.406: 56.12,2.98 X4.3
  Bottom 0.254: v29.52,35.37 23.89,35.37 23.89,41.15 7.6,41.15 7.6,15.64
  Bottom 0.406: 7.6,15.64 v7.65,15.64
CODEUSE1_TIM  (via drill 0.4, 0.5)
  Top 0.254: U$1.29 30.55,34.62 | v8.75,15.65 8.68,15.09 25.23,15.09 25.21,1.64 49.2,1.67 52.89,5.35 55.7,5.35 57.35,7
  Top 0.406: 30.55,34.62 v30.57,34.62 | 57.35,7 57.35,8.05 X4.2
  Bottom 0.254: v30.57,34.62 23.11,34.62 23.11,40.59 8.75,40.59 v8.75,15.65
CODEUSE2  (via drill 0.4, 0.5)
  Top 0.254: U$1.39 21.71,34.28 21.71,37.57 18.88,37.57 v18.88,37.62 | v10.91,16.71 26.86,16.71 26.86,3.51 47.89,3.51 47.89,5.38 v50.24,7.73 | v57.94,18.1 59.22,16.83 X5.3
  Top 0.406: X5.3 59.81,16.72
  Bottom 0.254: v18.88,37.62 10.91,37.62 v10.91,16.71 | v50.24,7.73 54.24,7.73 57.94,11.43 v57.94,18.1
CODEUSE2_TIM  (via drill 0.4, 0.5)
  Top 0.254: U$1.38 22.55,34.78 22.55,38.42 19.79,38.43 v19.76,38.44 | v9.79,15.87 26.12,15.87 26.12,2.44 47.85,2.41 50.98,5.54 v50.98,8.68 | v57.05,18.08 57.03,18.09 X5.2
  Top 0.406: X5.2 55.16,18.09
  Bottom 0.254: v19.76,38.44 9.82,38.42 v9.79,15.87 | v50.98,8.68 51.9,9.72 55.1,9.72 57.05,11.67 v57.05,18.08
EYE1
  Top 0.254: U$1.27 31.55,41.66 34.19,41.66 34.19,43.35 36.11,43.35
  Top 0.406: 36.11,43.35 SV4.1
EYE2
  Top 0.254: SV5.1 31.05,43.54 U$1.28
GND  (via drill 0.4, 0.5, 0.6)
  Top 0.254: 39.27,38.51 v36.57,41.21 | U$1.44 26.71,31.78 v27.28,31.21 26.35,30.28 U$1.47 | U$1.8 30.55,28.83 v29.46,29.92 | v27.97,33.27 27.55,33.27 U$1.35 27.55,38.79 v27.26,38.79 | U$1.23 35.13,34.78 35.79,35.44 35.79,38.29 U5.2 | v32,17.67 31.93,17.6 U7.2 31.93,16.04 v31.88,15.99
  Top 0.406: SV5.3 SV4.3 | 37.81,26.54 U3.2 | U2.2 41.92,32.18 41.92,33.33 40.81,34.44 U1.2 37.41,34.44 v36.9,33.93 | U4.2 39.27,38.51 | U$3.P$9 20.47,47 20.92,46.55 22.44,46.55 22.95,47.06 22.95,48.54 U$3.P$5 | v59.21,31.77 59.21,28.38 v57.47,28.38 | 26.95,24.04 27.99,24.04 JP2.8 | TOIT.3 55.55,38.24 v56.12,38.24 | v47.17,9.16 47.17,9.51 v49.15,9.51 49.15,9.58 52.28,9.58 X4.6 52.28,5.77 v52.11,5.59 | v36.41,38.44 36.41,38.31 U5.2 | 58.38,48.6 58.5,48.47 TOIT.12 59.43,47.98 59.5,47.91
  Bottom 0.254: C4.2 32.4,34.12 32.4,32.63 31.68,31.91 v31.68,31.6 | v32,17.67 32,20.97 30.19,22.78 JP2.8 | C7.2 28.17,38.79 v27.26,38.79 | C8.2 37.04,35.38 37.04,37.62 36.41,38.25 v36.41,38.44 | v31.88,15.99 31.88,16.41
  Bottom 0.406: C4.2 C8.2 35.99,33.93 v36.9,33.93 | 28.25,36.73 C7.2 | C6.2 C13.2 | C3.1 38.29,27.88 C2.2 38.39,28.51 v40.24,28.51 | 58.01,38.47 57.64,38.1 | 58.01,38.47 60.12,40.58 60.12,47.78 C15.2 | U8.4 16.58,18.77 v16.58,21.54 | C16.1 13.08,18.21 v13.08,19.21 | v29.46,29.92 29.46,28.54 C5.2 | v22.7,19.94 20.85,19.94 R8.1 v19.27,22.74 v19.28,22.75 | C1.2 41.11,14.16 v42.08,15.13 | v56.12,38.24 56.35,38.47 58.01,38.47
  other vias: 50.15,12.44 32.46,6.7 40.19,5.9 14.05,23.09 15.52,43.16 19.05,43.19 43.4,33.29 50.99,19.01 52.3,17.51 52.3,13.82 59.99,49.84 1.21,45.85 5.04,46.8 1.25,42 5.25,38 5.25,42 1.25,38 1.25,34 1.19,30 1.25,26 1.25,22 6.25,22 5.91,16.26 4.1,14.23 1.25,16 1.25,12 1.25,8 1.25,4 1.25,1 5.25,1 9.25,1 14.4,0.94 5.25,4.14 9.32,4.31 1.25,51 5.25,51 14.25,51 16.25,51 52.11,22.18 53.25,20 56.99,20.01 54.72,23.85 50.63,24.96 46.61,26.89 50.25,28.3 60.19,12.78 60.25,8.5 60.25,4.5 61.28,1.01 58.1,33.56 59.5,33.53 12.25,33.5 13.55,30.5 18.25,30.5 28.55,43.5 33.41,40.48 27.13,49.12 29.12,49.12 18.25,3 17.7,27.45 32.58,14.09 32.54,11.18 33.26,19.85 9.98,12.25 8.42,9.2 11.36,39.52 15.78,39.62 19.19,39.66 23.55,3.1 19.65,10.1
  pour Bottom (isolate 0.254): -0.64,52.97 -0.64,-1.16 49.52,-1.16 63.06,-1.16 63.06,52.86 -0.62,52.86 -0.62,52.62
  pour Top (isolate 0.254): 0.22,52.52 62.96,52.52 62.96,-0.73 -0.09,-0.73 -0.09,52.53
IMU_SCL
  Top 0.254: U$1.42 19.84,32.78 19.84,35.14 5.18,35.14 SV1.5
IMU_SDA
  Top 0.254: U$1.43 19.8,32.28 19.8,31.89 5.18,31.89 SV1.4
JACK  (via drill 0.4, 0.5)
  Top 0.254: U$1.15 38.89,30.78 v39.27,31.16 | TOIT.2 58.61,35.77 v57.5,36.98
  Bottom 0.254: v39.27,31.16 44,31.16 46.11,33.27 53.79,33.27 v57.5,36.98
LED1  (via drill 0.5)
  Top 0.254: U$1.22 35.26,34.28 36.67,35.69 36.67,37.21 v38.3,37.21
  Bottom 0.254: R5.1 49.72,47.27 47.62,45.17 47.08,45.17 40.23,38.32 38.31,38.32 38.3,38.31 v38.3,37.21
LED2  (via drill 0.5)
  Top 0.254: U$1.17 36.55,31.78 37.72,32.95 38.72,32.95
  Top 0.406: 38.72,32.95 v38.75,32.92
  Bottom 0.254: 51.58,42.15 49.64,42.15 49.64,40.07 45.89,40.07 45.59,39.77 45.59,38.17 45.12,38.17 45.12,37.07 40.97,32.92 v38.75,32.92
  Bottom 0.406: 51.58,42.15 R3.1
LED3  (via drill 0.5)
  Top 0.254: U$1.16 37.43,31.28 v38.04,31.89
  Bottom 0.254: v38.04,31.89 41.91,31.89 41.91,32.84 45.75,36.68 45.75,37.75 47.19,39.19 51.17,39.19 arc90 R4.1
  Bottom 0.406: R4.1 51.55,39.57
LED4  (via drill 0.5)
  Top 0.254: U$1.21 35.67,33.78 36.9,35.01 39.31,35.01 39.31,37.01 39.75,37.01 v40.17,37.43
  Bottom 0.254: v40.17,37.43 47.36,44.62 R2.1
MCU_RESET  (via drill 0.5)
  Top 0.254: U$3.P$10 20.47,39.75 v21.85,39.75 | U$1.7 v30.05,26.68 31.74,24.99 33.74,24.99 35.11,23.62 38.6,23.62 41.75,26.77 44.59,26.77 44.6,26.76 51.48,33.64 51.48,39.8 53.8,42.12 | 56.82,42.12 TOIT.7 | 56.82,42.12 v56.82,49.97 | R19.1 56.82,42.12
  Top 0.406: TOIT.7 53.8,42.12 53.2,42.12
  Bottom 0.254: v21.85,39.75 21.85,27.37 25.75,27.37 25.75,26.68 v30.05,26.68 | v56.82,49.97 57.48,49.97 C15.1
MOTOR1_1
  Top 0.406: JP1.5 45.14,12.52 47.41,10.25 54.18,10.25 54.83,9.6 X4.4
MOTOR1_2  (via drill 0.5)
  Top 0.406: X4.5 53.56,2.78 v52.17,2.78
  Bottom 0.406: v52.17,2.78 48.4,7 48.4,12.95 46.29,15.06 JP1.4
MOTOR1_PWM  (via drill 0.4)
  Top 0.254: JP2.3 29.68,9.65 U6.1 34.7,11.37 v34.7,14.49 | v34,26.05 34,26.58 U$1.12
  Bottom 0.254: v34.7,14.49 34.7,24.48 34.01,25.17 v34.01,26.04 v34,26.05
MOTOR1_PWM_N
  Top 0.254: JP2.2 30.42,8.71 U6.3 35.52,10.22 R6.1
MOTOR2_1
  Top 0.406: X5.4 50.7,15.55 49.73,16.53 44.49,16.53 JP1.3
MOTOR2_2
  Top 0.406: X5.5 57.68,14.29 57.68,16.78 51.28,16.78 51.28,16.8 50.62,16.8 49.65,17.77 48.32,17.77 45.95,20.14 JP1.2
MOTOR2_PWM  (via drill 0.5)
  Top 0.254: v36.1,20.35 36.1,18.6 U7.1 33.13,18.6 33.13,15.16 JP2.5 | v35.46,24.69 35.48,24.71 35.48,29.35 35.05,29.78 U$1.13
  Bottom 0.254: v36.1,20.35 36.1,24.67 36.08,24.69 v35.46,24.69
MOTOR2_PWM_N  (via drill 0.4)
  Top 0.254: U7.3 34.47,17.44 v33.84,16.81 | R7.1 32.92,21.07 30.8,18.95 30.5,18.95 JP2.6
  Bottom 0.254: v33.84,16.81 30.14,16.81 JP2.6
N$1  (via drill 0.5)
  Top 0.406: v53.51,48.7 54.35,48.7 TOIT.11
  Bottom 0.406: R5.2 53.51,47.27 v53.51,48.7
N$2  (via drill 0.4)
  Top 0.406: TOIT.10 59.3,45.8 v59.3,44.78
  Bottom 0.406: v59.3,44.78 56.55,42.13 R3.2
N$3  (via drill 0.4)
  Top 0.406: TOIT.9 54.89,44.66 v54.89,45.81
  Bottom 0.406: 53.55,44.66 R2.2 53.55,45.81 v54.89,45.81
N$4  (via drill 0.4)
  Top 0.406: TOIT.8 58.5,42.47 v58.3,42.24
  Bottom 0.406: v58.3,42.24 55.65,39.59 R4.2
N$5  (via drill 0.5)
  Top 0.406: U1.3 v41.28,36.31 D1.A | v44.74,39.01 44.74,40.97 45.47,41.7 45.47,45.7 43.08,48.09 43.08,48.7 PNEUMATIC.3
  Bottom 0.406: v41.28,36.31 42.04,36.31 v44.74,39.01
N$6
  Top 0.406: D2.A | PNEUMATIC.4 44.19,41.35 D2.A | D2.A 44.61,37.53 44.61,33.27 U2.3
N$7
  Top 0.406: PNEUMATIC.6 D3.A 45.69,39.82 45.69,31.5 41.6,27.41 U3.3 40.44,27.41
N$8
  Top 0.406: 41.26,43.78 PNEUMATIC.2 41.66,42.95 D6.A 39.75,40.85 U4.3
N$9  (via drill 0.5)
  Top 0.254: 38.59,46.04 38.6,46.03
  Top 0.406: PNEUMATIC.7 48.03,48.86 48.41,48.48 | 48,48.76 PNEUMATIC.7 | U5.3 36.07,42.09 37.73,42.09 38.59,42.95 38.59,46.04 | 38.6,46.03 v39.93,46.03 | PNEUMATIC.7 46.99,48.86 v46.78,48.85
  Bottom 0.406: v39.93,46.03 41.56,47.66 47.16,47.66 | 47.16,47.66 D7.A | v46.78,48.85 46.78,47.84 47.16,47.66
N$11  (via drill 0.5)
  Top 0.254: U$1.2 27.55,26.54 v28.33,25.76
  Bottom 0.254: v28.33,25.76 25.84,25.76
  Bottom 0.406: 25.84,25.76 R1.1
N$13
  Bottom 0.254: R8.2 23.56,21.52 U$2.VADJ
N$14
  Bottom 0.254: R15.2 12.75,23.74 11.67,22.66 11.67,19.86 14.73,19.86 14.73,14.96 U8.1
N$15
  Bottom 0.254: R15.1 14.65,33.42 LD1.CR
N$16  (via drill 0.5)
  Top 0.254: v20.41,27.73 20.41,21.13 v18.99,19.71
  Bottom 0.254: 20.41,29.05 v20.41,27.73 | U8.7 18.99,16.23 v18.99,19.71
  Bottom 0.406: R14.2 20.41,29.05 | 21.11,16.25 U8.7
N$17
  Bottom 0.254: R14.1 20.47,33.42 LD1.CX
N$18  (via drill 0.5)
  Top 0.254: v24.62,22.53 25.05,22.96 25.05,25.6 23.66,26.99 23.27,26.99 22.39,27.87 LED1.A
  Bottom 0.254: R1.2 24.62,23.69 v24.62,22.53
N$19  (via drill 0.5)
  Top 0.254: 11.82,17.51 v17.69,17.51 22.36,17.51 v22.87,18.02
  Top 0.406: 11.82,17.51 v11.82,17.86
  Bottom 0.254: 23.32,17.48 C11.1 | 23.32,17.48 21.11,17.48 | v22.87,18.02 22.87,17.93 23.32,17.48 | v17.69,17.51 U8.3
  Bottom 0.406: R10.1 16.31,9.35 R9.2 16.31,11.13 11.89,11.13 11.89,17.86 v11.82,17.86 | 24.43,17.51 C11.1 | 21.11,17.48 U8.6
N$20
  Bottom 0.254: R12.2 R11.1 | 18.39,24.05 R12.2 | 16.19,16.26 18.29,16.26 18.34,16.31 18.34,17.77 17.85,18.26 17.85,22.7 18.75,23.6 R12.2
  Bottom 0.406: 16.19,16.26 U8.2
N$21  (via drill 0.5)
  Top 0.254: v15.58,19.8 17,19.8 18.02,18.78 19.71,18.78 19.72,18.77 v20.34,18.77
  Bottom 0.254: R12.1 R13.2 15.08,25.95 C12.1 15.08,20.3 v15.58,19.8
  Bottom 0.406: U8.5 v20.34,18.77
N$23  (via drill 0.5)
  Top 0.254: AX12-2.P$3 44.32,29.1 v44.32,28.28 | v52.54,32.36 52.54,27.58 58.47,27.58 AX12.P$3 | R20.2 41.02,8.83 41.02,21.01 arc90 v40.89,21.14 39.36,21.14 U9.3
  Top 0.406: AX12.P$3
  Bottom 0.254: AX12-2.P$3 47.58,32.36 v52.54,32.36 | v44.32,28.28 42.22,26.18 42.22,21.14 v40.89,21.14
N$24  (via drill 0.5)
  Top 0.406: v48.46,15.36 48.44,15.36 R16.2
  Bottom 0.406: T1.1 48.46,16.46 v48.46,15.36
N$25  (via drill 0.4, 0.5)
  Top 0.254: v50.63,22.43 48.91,24.15 42.6,24.15 v41.55,23.1 D9.A | U9.2 40.13,19.34 v40.13,20.19
  Bottom 0.254: R17.2 | 48.44,18.87 T1.2 48.44,19.98 50.65,19.98 R17.2 | R17.2 v50.64,22.42 v50.63,22.43 | 41.29,23.1 v41.55,23.1 41.53,23.08 40.76,23.08 40.47,22.79 40.47,22.28 40.13,21.94 v40.13,20.19
PUMP
  Top 0.254: U$1.25 32.55,38.31 U5.1
SENSOR1
  Top 0.254: 25.3,33.26 U$1.41 20.44,33.28 20.44,35.87 8.49,35.87 X1.2
  Top 0.406: 8.58,44 X1.2 8.45,44
SENSOR2  (via drill 0.5)
  Top 0.254: X1.3 11.02,49.08 v11.02,46.54 | v28.43,46.54 29.87,46.54 29.87,41.87 30.53,41.87 30.53,38.6 29.55,38.6 U$1.31
  Bottom 0.254: v11.02,46.54 v28.43,46.54
SENSOR3  (via drill 0.4, 0.5)
  Top 0.254: X1.5 15.85,49.08 v15.85,44.93 | U$1.32 29.05,40.34 v29.86,41.15
  Bottom 0.254: v15.85,44.93 29.89,44.93 29.86,44.9 v29.86,41.15
SENSOR4  (via drill 0.5)
  Top 0.254: 28.55,41.83 U$1.33
  Top 0.406: X1.4 11.45,42.8 v12.35,41.9 | v28.52,41.83 28.55,41.83
  Bottom 0.254: v12.35,41.9 28.52,41.9
  Bottom 0.406: 28.52,41.9 v28.52,41.83
SWCLK
  Top 0.254: U$3.P$4 24.27,35.27 U$1.37
  Top 0.406: U$3.P$4
SWDIO
  Top 0.254: 28.06,37.55 28.06,38.03 | 28.06,37.55 U$1.34 | 28.06,37.55 28.06,39.84 25.55,39.84 U$3.P$2
VALVE1
  Top 0.254: U4.1 37.38,39.4 34.86,39.4 34.86,37.3 33,35.44 33,33.28 U$1.20
  Top 0.406: U4.1
VALVE2  (via drill 0.4)
  Top 0.254: U$1.19 | U$1.19 33.57,32.78 32.68,31.89 v32.68,31.86 | v37.86,35.7 U1.1
  Top 0.406: U1.1
  Bottom 0.254: v37.86,35.7 37.86,33.8 35.92,31.86 v32.68,31.86
VALVE3
  Top 0.254: U$1.18 36.24,32.28 37.66,33.7 39.72,33.7 U2.1
VALVE4
  Top 0.254: U$1.14 35.88,30.28 U3.1

### Text on the board
tNames: TelecomRobotics | WALL-E 2017